# EasyEDA Pro project 单轴带屏幕.eprj, board PCB
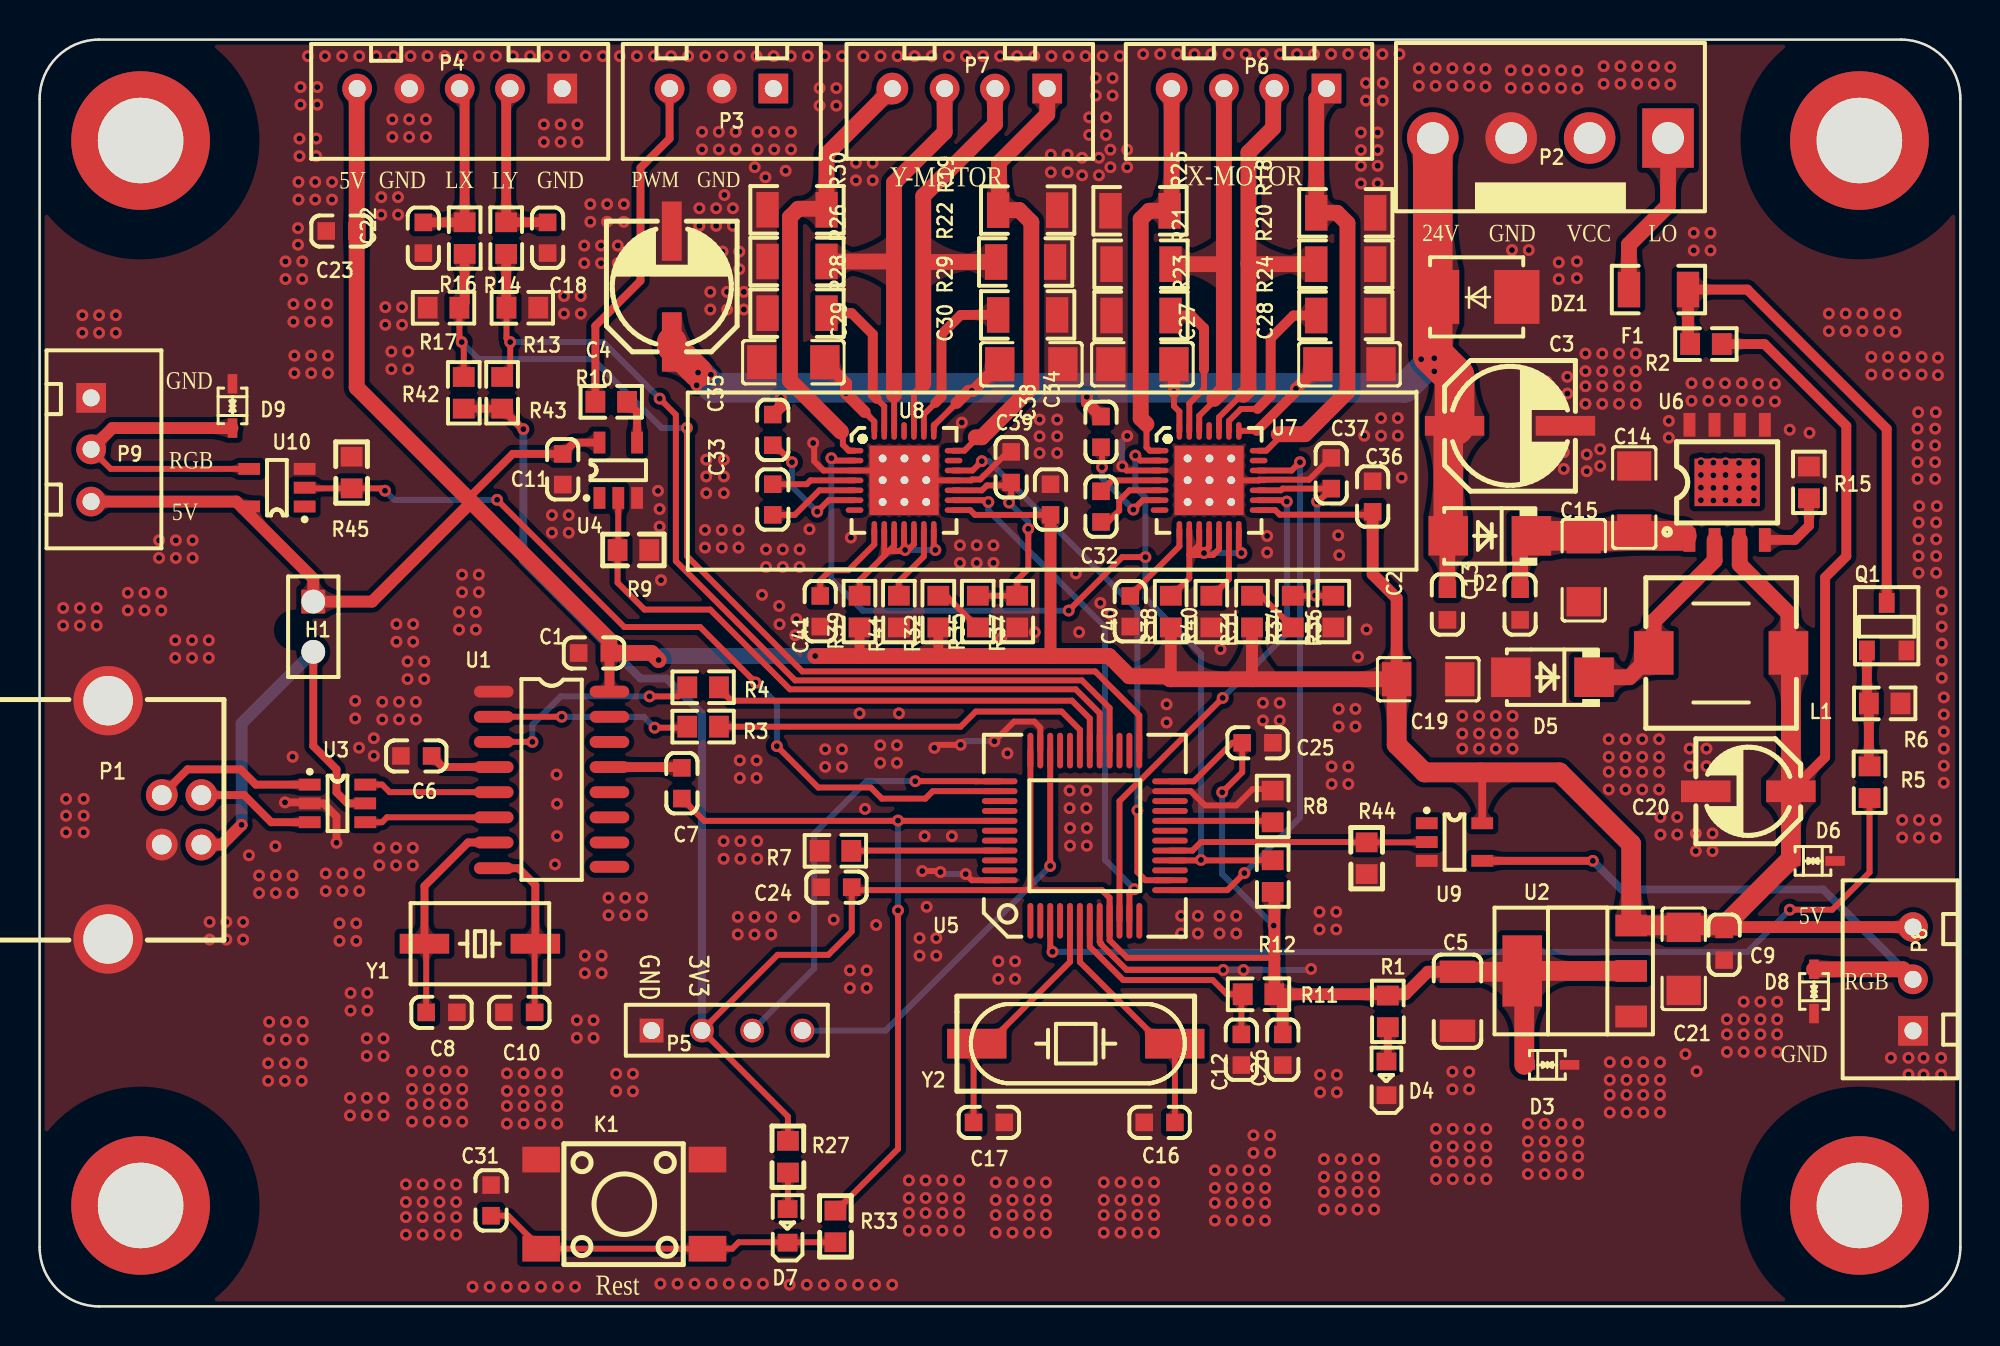
[diagram p1: board, top side]
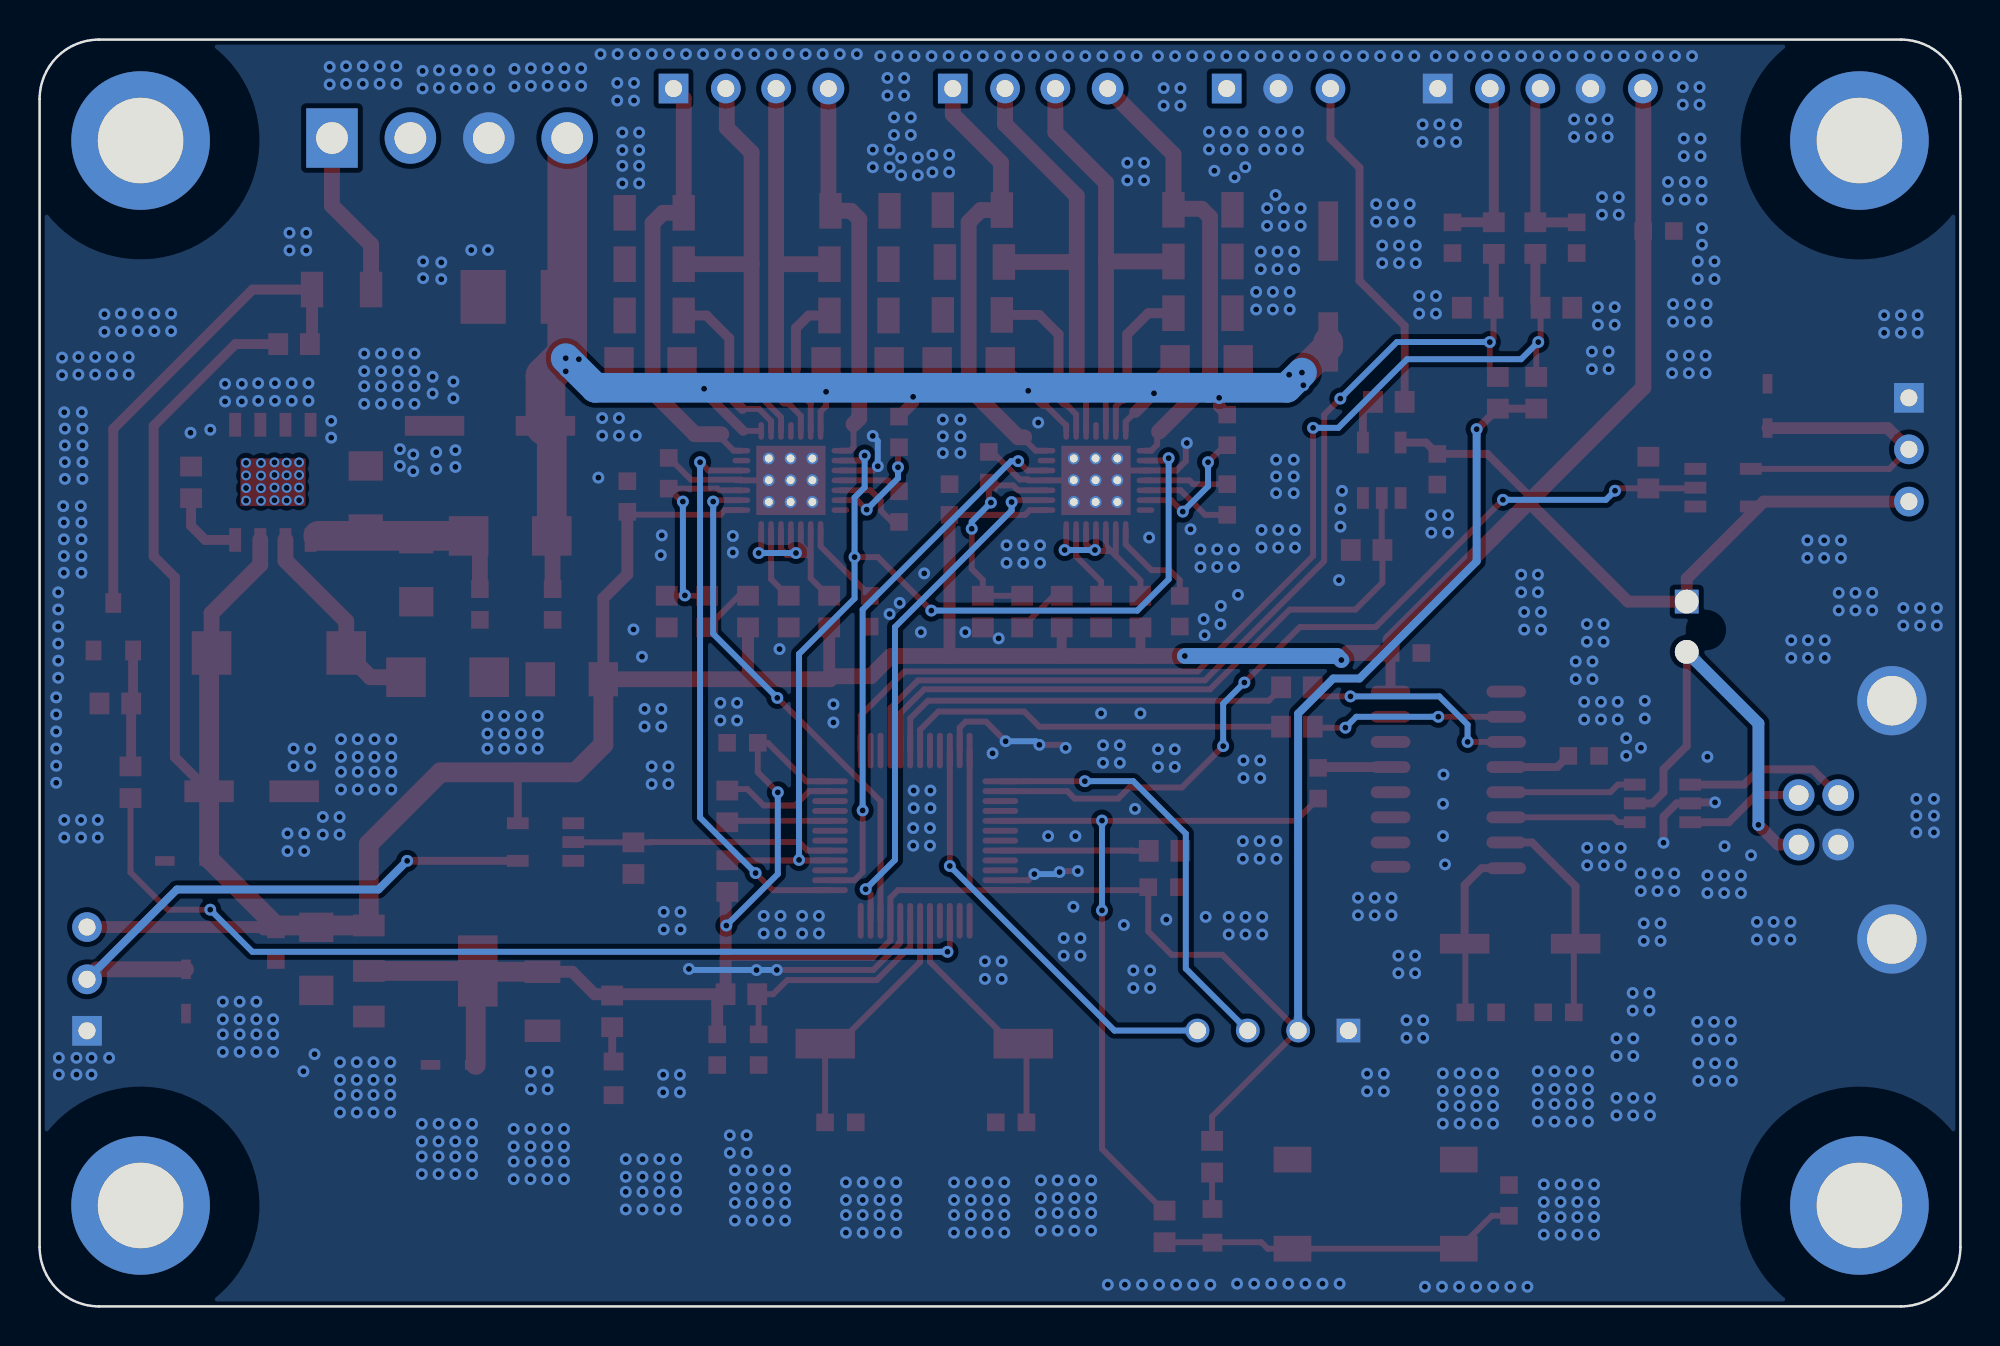
[diagram p2: board, bottom side, seen from below]

Outline 97 x 64 mm; copper layers: Top Layer, Bottom Layer. Coordinates in mm from the lower left corner of the outline.
Outline path: 0,61 0,3 arc(0.88,0.88) 3,0 94,0 arc(96.12,0.88) 97,3 97,61 arc(96.12,63.12) 94,64 3,64 arc(0.88,63.12) 0,61
Stack: Top Layer 0.035mm / Dielectric1 1.51mm FR4 er 4.5 / Bottom Layer 0.035mm

## Design rules (mm)
template: 用户自定义配置
spacing Default (default): track to track 0.152, other pairs 0 to 0.152
track width Default (default): min 0.254, default 0.254, max 25.4
differential pair differentialPair (default): width min 0.127, default 0.254, max 2.54; gap min 0.152, default 0.152
via Default (default): diameter min 0.25, default 0.61, max 100.025; hole min 0.2, default 0.305, max 59.995

## Placement (name value [footprint] x y rotation side)
C1  104  [0603C]  28 33.01 180 top
C2  104  [0603C]  71.09 35.46 270 top
C3  100uF/35V  [电解电容贴片6X6]  74.26 44.49 0 top
C4  100uF/35V  [电解电容贴片6X6]  31.93 51.52 90 top
C5  106/50V  [1206C]  71.6 15.42 270 top
C6  104  [0603C]  19.02 27.81 180 top
C7  104  [0603C]  32.44 26.43 270 top
C8  18pF  [0603C]  20.3 14.86 0 top
C9  104  [0603C]  85.07 18.27 90 top
C10  18pF  [0603C]  24.22 14.86 180 top
C11  104  [0603C]  26.42 42.29 90 top
C12  104  [0603C]  60.69 12.97 90 top
C13  104  [0603C]  74.77 35.46 90 top
C14  10uF  [C1206]  80.53 40.87 90 top
C15  10uF  [C1206]  77.98 37.19 90 top
C16  100pF  [0603C]  56.56 9.3 180 top
C17  100pF  [0603C]  47.94 9.3 0 top
C18  104  [0603C]  25.65 53.99 270 top
C19  10uF  [C1206]  70.12 31.69 0 top
C20  100uF/10V  [CAP-SMD_BD5.0-L5.3-W5.3-RD]  86.29 26.02 0 top
C21  10uF  [C1206]  83.03 17.56 270 top
C22  104  [0603C]  19.38 53.99 90 top
C23  104  [0603C]  15.25 54.33 0 top
C24  104  [0603C]  40.24 21.18 0 top
C25  104  [0603C]  61.51 28.47 180 top
C26  104  [0603C]  62.78 12.97 90 top
C27  10uF  [C1206]  55.69 47.6 180 top
C28  10uF  [C1206]  66.15 47.6 0 top
C29  10uF  [C1206]  38.06 47.7 180 top
C30  10uF  [C1206]  50.08 47.6 0 top
C31  103  [0603C]  22.8 5.36 270 top
C32  104  [0603C]  53.6 40.41 270 top
C33  104  [0603C]  37.03 40.76 270 top
C34  104  [0603C]  53.6 44.18 90 top
C35  104  [0603C]  37.03 44.28 90 top
C36  104  [0603C]  67.32 40.92 90 top
C37  104  [0603C]  65.23 42.09 90 top
C38  104  [0603C]  51.05 40.76 90 top
C39  104  [0603C]  49.06 42.4 90 top
C40  224  [0603C]  55.08 35.12 270 top
C41  224  [0603C]  39.42 35.12 270 top
D2  SS56  [SMA]  73.24 38.93 180 top
D3  PESD3V3L1BA-N  [SOD-323_L1.8-W1.3-LS2.5-BI]  76.14 12.2 180 top
D4  绿光  [0603LED]  68.03 11.49 270 top
D5  SS34  [SMA]  76.4 31.79 180 top
D6  PESD5V0L1BA-N  [SOD-323_L1.8-W1.3-LS2.5-BI]  89.56 22.51 180 top
D7  绿光  [0603LED]  37.79 4.04 270 top
D8  绿光  [SOD-323_L1.8-W1.3-LS2.5-BI]  89.61 15.91 90 top
D9  绿光  [SOD-323_L1.8-W1.3-LS2.5-BI]  9.74 45.49 270 top
DZ1  SMBJ28A  [SMB]  72.57 51 0 top
F1  6V/0.75A  [1206R]  81.75 51.37 180 top
H1  PZ254V-11-02P  [HDR-TH_2P-P2.54-V-M]  13.82 34.34 270 top
K1  SW_6X6_H=12.0MM  [KEY-SMD_4P-L6.0-W6.0-P4.50-LS9.0]  29.53 5.17 0 top
L1  68uH  [IND-SMD_L7.0-W7.0_SMDRI74-330MT]  84.92 33.01 180 top
NOREF  -  [Pad_ie3625]  42.57 40.64 180 top
NOREF#2  -  [Pad_ie3626]  60.18 42.84 0 top
NOREF#3  -  [Pad_ie3620]  42.57 41.74 180 top
NOREF#4  -  [Pad_ie3627]  59.08 42.84 0 top
NOREF#5  -  [Pad_ie3619]  42.57 42.84 180 top
NOREF#6  -  [Pad_ie3]  91.9 5.1 180 top
NOREF#7  -  [Pad_ie3628]  57.98 42.84 180 top
NOREF#8  -  [Pad_ie1]  5.1 58.9 0 top
NOREF#9  -  [Pad_ie3634]  57.98 40.64 180 top
NOREF#10  -  [Pad_ie3617]  44.77 42.84 0 top
NOREF#11  -  [Pad_ie3631]  60.18 41.74 0 top
NOREF#12  -  [Pad_ie0]  5.1 5.1 90 top
NOREF#13  -  [Pad_ie3622]  44.77 41.74 0 top
NOREF#14  -  [Pad_ie2]  91.9 58.9 270 top
NOREF#15  -  [Pad_ie3624]  43.67 40.64 270 top
NOREF#16  -  [Pad_ie3629]  57.98 41.74 180 top
NOREF#17  -  [Pad_ie3633]  59.08 40.64 270 top
NOREF#18  -  [Pad_ie3632]  60.18 40.64 0 top
NOREF#19  -  [Pad_ie3623]  44.77 40.64 0 top
NOREF#20  -  [Pad_ie3630]  59.08 41.74 270 top
NOREF#21  -  [Pad_ie3618]  43.67 42.84 0 top
NOREF#22  -  [Pad_ie3621]  43.67 41.74 270 top
P1  TYPE-C 16PIN  [USB-B-TH_USB-B10-BRW]  5.81 24.58 270 top
P2  Header 4  [VH3.96-4P直插座]  76.3 59.33 0 top
P3  3P  [HDR1X3_CON]  34.45 61.53 180 top
P4  Header 5  [HDR1X5_CON]  21.21 61.53 180 top
P5  4P  [SIP4]  30.91 13.94 0 top
P6  4P  [HDR1X4_CON]  64.89 61.53 180 top
P7  4P  [HDR1X4_CON]  50.78 61.53 180 top
P8  3P  [HDR1X3_CON]  94.61 16.52 90 top
P9  2P  [HDR1X3_CON]  2.6 43.3 270 top
Q1  S8050  [SOT-23]  93.28 34.34 0 top
R1  10K  [0603R]  68.08 14.91 270 top
R2  5.1K  [0603R]  84.15 48.62 180 top
R3  510Ω  [0603R]  33.51 29.29 0 top
R4  510Ω  [0603R]  33.51 31.28 0 top
R5  2K  [0603R]  92.41 26.48 270 top
R6  10K  [0603R]  93.18 30.46 0 top
R7  10K  [0603R]  40.19 23.02 0 top
R8  10K  [0603R]  62.27 25.26 270 top
R9  10K  [0603R]  29.99 38.21 0 top
R10  100  [0603R]  28.87 45.7 0 top
R11  10K  [0603R]  61.56 15.77 180 top
R12  10K  [0603R]  62.27 21.74 270 top
R13  10K  [0603R]  24.38 50.45 180 top
R14  100Ω  [0603R]  23.56 53.97 270 top
R15  10K  [0603R]  89.35 41.63 90 top
R16  100Ω  [0603R]  21.46 53.97 270 top
R17  10K  [0603R]  20.4 50.45 180 top
R18  1.91K  [1206R]  65.96 55.25 0 top
R19  1.91K  [1206R]  49.9 55.39 0 top
R20  1.91K  [1206R]  65.96 52.65 0 top
R21  1.91K  [1206R]  55.62 52.65 180 top
R22  1.91K  [1206R]  49.79 52.76 0 top
R23  0.1  [1206R]  55.62 50.06 180 top
R24  0.1  [1206R]  65.96 50.06 180 top
R25  1.91K  [1206R]  55.57 55.35 180 top
R26  1.91K  [1206R]  38.25 52.79 180 top
R27  10K  [0603R]  37.79 7.56 90 top
R28  0.1  [1206R]  38.25 50.18 180 top
R29  0.1  [1206R]  49.9 50.09 180 top
R30  1.91K  [1206R]  38.25 55.4 180 top
R31  10K  [0603R]  61.23 35.1 270 top
R32  10K  [0603R]  45.39 35.1 270 top
R33  100  [0603R]  40.19 4.04 270 top
R34  10K  [0603R]  63.28 35.1 90 top
R35  10K  [0603R]  47.38 35.1 90 top
R36  10K  [0603R]  65.33 35.1 270 top
R37  10K  [0603R]  49.37 35.1 270 top
R38  10K  [0603R]  57.13 35.1 90 top
R39  10K  [0603R]  41.41 35.1 90 top
R40  10K  [0603R]  59.17 35.1 270 top
R41  10K  [0603R]  43.39 35.1 270 top
R42  10K  [0603R]  21.42 46.16 270 top
R43  10K  [0603R]  23.36 46.16 90 top
R44  10K  [0603R]  67.01 22.64 270 top
R45  100  [0603R]  15.76 42.13 90 top
U1  CH340G  [SOP16]  25.86 27.25 0 top
U2  1117-3.3  [SOT-223]  77.67 16.95 90 top
U3  USBLC2-2SC6  [SOT-23-6]  15.04 25.41 0 top
U4  74LVC1G17  [SOT-23-5]  29.22 42.24 90 top
U5  GD32F303CCT6  [LQFP48]  52.78 23.78 90 top
U6  XL1509-5.0E1  [ESOP-8_L4.9-W3.9-P1.27-LS6.0-BL-EP]  85.22 41.63 0 top
U7  HR4988SQ  [QFN28]  59.32 41.63 270 top
U8  HR4988SQ  [QFN28]  43.91 41.63 270 top
U9  74LVC1G17  [SOT-23-5]  71.45 23.46 0 top
U10  74LVC1G17  [SOT-23-5]  11.98 41.36 180 top
Y1  12M  [晶振贴片49SSMD]  22.23 18.32 180 top
Y2  8M  [晶振贴片]  52.33 13.27 0 top

## Footprints (pads in the part's own frame, mm; a bottom-side part is the same pattern mirrored in y, then rotated)
0603C
  rect 0.889x0.889 smd: 1(-0.774,0) 2(0.774,0)
0603LED
  rect 0.9x1 smd: 1(-0.884,-0.017) 2(0.816,-0.017)
0603R
  rect 1x1.1 smd: 1(-0.8,0) 2(0.8,0)
1206C
  rect 1.13x1.8 smd: 1(-1.49,0) 2(1.49,0)
1206R
  rect 1.13x1.8 smd: 1(-1.49,0) 2(1.49,0)
C1206
  rect 1.485x1.728 smd: 1(-1.593,0) 2(1.593,0)
CAP-SMD_BD5.0-L5.3-W5.3-RD
  rect 2.5x1.1 smd: 1(2.15,0) 2(-2.15,0)
ESOP-8_L4.9-W3.9-P1.27-LS6.0-BL-EP
  rect 0.6x1.2 smd: 1(-1.905,-2.909) 2(-0.635,-2.909) 3(0.635,-2.909) 4(1.905,-2.909) 5(1.905,2.909) 6(0.635,2.909) 7(-0.635,2.909) 8(-1.905,2.909)
  rect 3.3x2.4 smd: 9(0,0)
HDR1X3_CON
  rect 1.5x1.5 hole 0.86: 1(-2.6,0)
  round 1.5 hole 0.86: 2(0,0) 3(2.64,0)
HDR1X4_CON
  rect 1.5x1.5 hole 0.86: 1(-0.1,0)
  round 1.5 hole 0.86: 2(2.54,0) 3(5.08,0)
  round 1.6 hole 0.85: 4(7.72,0)
HDR1X5_CON
  rect 1.5x1.5 hole 0.86: 1(-5.18,0)
  round 1.5 hole 0.86: 2(-2.54,0) 3(0,0) 4(2.54,0) 5(5.18,0)
HDR-TH_2P-P2.54-V-M
  rect 1.2x1.2 hole 1.2x0.8: 1(-1.27,0)
  round 1.2 hole 1.2x0.8: 2(1.27,0)
IND-SMD_L7.0-W7.0_SMDRI74-330MT
  rect 2x2.2 smd: 1(-3.4,0) 2(3.4,0)
KEY-SMD_4P-L6.0-W6.0-P4.50-LS9.0
  rect 1.9x1.3 smd: 1(-4.2,2.25) 2(4.2,2.25) 3(-4.2,-2.25) 4(4.2,-2.25)
LQFP48
  oval 1.8x0.3 smd: 1(-4.3,2.75) 2(-4.3,2.25) 3(-4.3,1.75) 4(-4.3,1.25) 5(-4.3,0.75) 6(-4.3,0.25) 7(-4.3,-0.25) 8(-4.3,-0.75) 9(-4.3,-1.25) 10(-4.3,-1.75) 11(-4.3,-2.25) 12(-4.3,-2.75) 25(4.3,-2.75) 26(4.3,-2.25) 27(4.3,-1.75) 28(4.3,-1.25) 29(4.3,-0.75) 30(4.3,-0.25) 31(4.3,0.25) 32(4.3,0.75) 33(4.3,1.25) 34(4.3,1.75) 35(4.3,2.25) 36(4.3,2.75)
  oval 0.3x1.8 smd: 13(-2.75,-4.3) 14(-2.25,-4.3) 15(-1.75,-4.3) 16(-1.25,-4.3) 17(-0.75,-4.3) 18(-0.25,-4.3) 19(0.25,-4.3) 20(0.75,-4.3) 21(1.25,-4.3) 22(1.75,-4.3) 23(2.25,-4.3) 24(2.75,-4.3) 37(2.75,4.3) 38(2.25,4.3) 39(1.75,4.3) 40(1.25,4.3) 41(0.75,4.3) 42(0.25,4.3) 43(-0.25,4.3) 44(-0.75,4.3) 45(-1.25,4.3) 46(-1.75,4.3) 47(-2.25,4.3) 48(-2.75,4.3)
Pad_ie0
  round 7 hole 4.32: 0(0,0)
Pad_ie1
  round 7 hole 4.32: 0(0,0)
Pad_ie2
  round 7 hole 4.32: 0(0,0)
Pad_ie3
  round 7 hole 4.32: 0(0,0)
Pad_ie3617
  round 0.6 hole 0.4: 5(0,0)
Pad_ie3618
  round 0.6 hole 0.4: 4(0,0)
Pad_ie3619
  round 0.6 hole 0.4: 5(0,0)
Pad_ie3620
  round 0.6 hole 0.4: 5(0,0)
Pad_ie3621
  round 0.6 hole 0.4: 5(0,0)
Pad_ie3622
  round 0.6 hole 0.4: 5(0,0)
Pad_ie3623
  round 0.6 hole 0.4: 5(0,0)
Pad_ie3624
  round 0.6 hole 0.4: 5(0,0)
Pad_ie3625
  round 0.6 hole 0.4: 5(0,0)
Pad_ie3626
  round 0.6 hole 0.4: 5(0,0)
Pad_ie3627
  round 0.6 hole 0.4: 4(0,0)
Pad_ie3628
  round 0.6 hole 0.4: 5(0,0)
Pad_ie3629
  round 0.6 hole 0.4: 5(0,0)
Pad_ie3630
  round 0.6 hole 0.4: 5(0,0)
Pad_ie3631
  round 0.6 hole 0.4: 5(0,0)
Pad_ie3632
  round 0.6 hole 0.4: 5(0,0)
Pad_ie3633
  round 0.6 hole 0.4: 5(0,0)
Pad_ie3634
  round 0.6 hole 0.4: 5(0,0)
QFN28
  oval 0.28x0.895 smd: 1(-1.601,-2.756) 2(-1.101,-2.756) 3(-0.601,-2.756) 4(-0.1,-2.756) 5(0.401,-2.756) 6(0.9,-2.756) 7(1.401,-2.756) 15(1.401,2.244) 16(0.9,2.244) 17(0.401,2.244) 18(-0.1,2.244) 19(-0.601,2.244) 20(-1.101,2.244) 21(-1.601,2.244)
  oval 0.895x0.28 smd: 8(2.4,-1.758) 9(2.4,-1.257) 10(2.4,-0.756) 11(2.4,-0.256) 12(2.4,0.244) 13(2.4,0.745) 14(2.4,1.245) 22(-2.6,1.245) 23(-2.6,0.745) 24(-2.6,0.244) 25(-2.6,-0.256) 26(-2.6,-0.756) 27(-2.6,-1.257) 28(-2.6,-1.758)
  rect 3.5x3.5 smd: 29(-0.1,-0.256)
SIP4
  rect 1.2x1.2 hole 0.86: 1(0,0)
  round 1.2 hole 0.86: 2(2.54,0) 3(5.08,0) 4(7.62,0)
SMA
  rect 2x2 smd: 1(2.1,0) 2(-2.1,0)
SMB
  rect 2.29x2.72 smd: 1(2.025,0) 2(-2.025,0)
SOD-323_L1.8-W1.3-LS2.5-BI
  rect 0.986x0.49 smd: 1(-1.117,0) 2(1.117,0)
SOP16
  oval 2x0.6 smd: 1(-2.921,3.81) 2(-2.921,2.54) 3(-2.921,1.27) 4(-2.921,0) 5(-2.921,-1.27) 6(-2.921,-2.54) 7(-2.921,-3.81) 8(-2.921,-5.11) 9(2.921,-5.04) 10(2.921,-3.81) 11(2.921,-2.54) 12(2.921,-1.27) 13(2.921,0) 14(2.921,1.27) 15(2.921,2.54) 16(2.921,3.81)
SOT-23
  rect 0.8x1 smd: 1(-1,-1.2) 2(0,1.2) 3(1,-1.2)
SOT-23-5
  rect 1.1x0.6 smd: 1(-1.4,0.95) 2(-1.4,0) 3(-1.4,-0.95) 4(1.4,-0.95) 5(1.4,0.95)
SOT-23-6
  rect 1.1x0.6 smd: 1(-1.4,0.95) 2(-1.4,0) 3(-1.4,-0.95) 4(1.4,-0.95) 5(1.4,0) 6(1.4,0.95)
SOT-223
  rect 1.1x1.6 smd: 1(-2.3,-2.7) 2(0,-2.7) 3(2.3,-2.7)
  rect 3.6x2 smd: 4(0,2.8)
USB-B-TH_USB-B10-BRW
  round 1.6 hole 1: 1(1.25,2.355) 2(-1.25,2.355) 3(-1.25,0.355) 4(1.25,0.355)
  round 3.5 hole 2.5: 5(-6.02,-2.355) 6(6.02,-2.355)
VH3.96-4P直插座
  rect 2.6x3 hole 1.6: 1(5.94,-0.3)
  round 2.6 hole 1.6: 2(1.98,-0.3) 3(-1.98,-0.3) 4(-5.94,-0.3)
晶振贴片
  rect 3x1.5 smd: 1(-5,0) 2(5,0)
晶振贴片49SSMD
  rect 2.5x1 smd: 1(-2.8,0) 2(2.8,0)
电解电容贴片6X6
  rect 3x1 smd: 1(-2.8,0) 2(2.8,0)

## Nets
3V3: C5.1 C24.2 C25.2 C26.2 D3.2 P5.2 R1.1 R11.1 R12.2 R27.2 R42.2 R43.1 U2.2 U2.4 U5.9 U5.24 U5.36 U5.48
5VV: P2.2
24V: C13.2 C14.1 C15.2 D2.2 U6.1
GND: C1.2 C2.2 C3.2 C4.2 C5.2 C6.2 C8.2 C9.1 C10.2 C11.1 C12.1 C13.1 C14.2 C15.1 C16.2 C17.2 C18.2 C19.2 C20.2 C21.2 C22.1 C23.1 C24.1 C25.1 C26.1 C27.2 C28.2 C29.2 C30.2 C31.1 C36.2 C37.2 C38.2 C39.2 C40.2 C41.2 D3.1 D4.2 D5.1 D6.1 D8.1 D9.1 DZ1.1 K1.1 K1.2 NOREF.5 NOREF#2.5 NOREF#3.5 NOREF#4.4 NOREF#5.5 NOREF#7.5 NOREF#9.5 NOREF#10.5 NOREF#11.5 NOREF#13.5 NOREF#15.5 NOREF#16.5 NOREF#17.5 NOREF#18.5 NOREF#19.5 NOREF#20.5 NOREF#21.4 NOREF#22.5 P1.4 P1.5 P1.6 P2.3 P3.2 P4.1 P4.4 P5.1 P8.1 P9.1 Q1.3 R6.2 R7.1 R8.1 R9.2 R13.1 R15.2 R17.2 R18.2 R19.2 R20.2 R21.2 R22.2 R23.2 R24.1 R25.2 R26.2 R28.2 R29.1 R30.2 R36.2 R37.2 R40.2 R41.2 R44.2 R45.2 U1.1 U2.1 U3.2 U4.3 U5.8 U5.23 U5.35 U5.47 U6.5 U6.6 U6.7 U6.8 U7.3 U7.18 U7.29 U8.3 U8.18 U8.29 U9.3 U10.3
VCC: C1.1 C9.2 C11.2 C19.1 C20.1 C21.1 C23.2 C36.1 C38.1 D6.2 H1.1 L1.1 P4.5 P8.3 P9.3 R2.1 R31.2 R32.2 R38.1 R39.1 U1.16 U2.3 U4.5 U6.3 U7.15 U8.15 U9.5 U10.5
BOOT0: R7.2 U5.44
BOOT1: R8.2 U5.20
COOLANT_FLOOD: U5.39
COOLANT_MIST: U5.40
EX1: U5.42
EX2: U5.43
EX3: U5.4
GYRO_RX: U5.22
GYRO_TX: U5.21
LASER_LOCATION: U5.19
LO: R5.2 U5.3
LO_OUT: F1.2 P2.1
LX_O: C22.2 P4.3 R16.1
LY_O: C18.1 P4.2 R14.1
MOTOR_EN: R12.1 U5.16 U7.2 U8.2
MX_1A: P6.2 R20.1 U7.24
MX_1B: P6.1 R18.1 U7.21
MX_2A: P6.3 R21.1 U7.26
MX_2B: P6.4 R25.1 U7.1
MX_DIR: U5.13 U7.19
MX_STEP: U5.10 U7.16
MY1_1A: P7.2 R22.1 U8.24
MY1_1B: P7.1 R19.1 U8.21
MY1_2A: P7.3 R26.1 U8.26
MY1_2B: P7.4 R30.1 U8.1
MY_DIR: U5.14 U8.19
MY_STEP: U5.11 U8.16
MZ_DIR: U5.15
MZ_STEP: U5.12
NRST: C12.2 R11.2 U5.7
PA7_SPI: R44.1 U5.17 U9.2
PA15: R45.1 U5.38 U10.2
PA15_TIM2: D9.2 P9.2 U10.4
PWM_5V: P3.3 R10.1
RGB_SPI: D8.2 P8.2 U9.4
RST: C7.2 R33.1 U5.41
RXD: R3.2 U5.31
SAFETY_DOOR: U5.45
SPINDLE_DIR: U5.27
SPINDLE_EN: U5.26
SPINDLE_PWM: R9.1 U4.2 U5.29
SWCLK: P5.3 U5.37
SWDIO: P5.4 U5.34
TXD: R4.2 U5.30
USB_DM: P1.2 U3.3
USB_DP: P1.3 U3.1
USBV_CK: U5.18
VM: C2.1 C3.1 C4.1 C27.1 C28.1 C29.1 C30.1 C34.2 C35.2 D2.1 DZ1.2 P2.4 U7.22 U7.28 U8.22 U8.28
VUSB: H1.2 P1.1 U3.5
X_LIMT: R16.2 R17.1 R42.1 U5.25
XTAL1: C17.1 U5.5 Y2.1
XTAL2: C16.1 U5.6 Y2.2
Y_LIMT: R13.2 R14.2 R43.2 U5.28
$1N85772: U5.32
$1N85774: U5.33
$1N85780: U5.46
$1N85854: U5.2
$1N85912: C32.2 U7.5
$1N85916: C32.1 U7.4
$1N85918: C34.1 U7.6
$1N85922: C40.1 U7.8
$1N85924: R40.1 U7.13
$1N85949: R24.2 U7.23
$1N85962: R23.1 U7.27
$1N85980: C33.2 U8.5
$1N85984: C33.1 U8.4
$1N85986: C35.1 U8.6
$1N85990: C41.1 U8.8
$1N85992: R41.1 U8.13
$1N86002: C39.1 R35.2 R37.1 U8.17
$1N86020: R29.2 U8.23
$1N86033: R28.1 U8.27
$1N86106: R38.2 U7.9 U7.10 U7.11 U7.12 U7.14
$1N86116: R39.2 U8.9 U8.10 U8.11 U8.12 U8.14
$1N86149: C6.1 U1.4
$1N86156: C7.1 U1.13
$1N86170: U1.5 U3.6
$1N86179: U1.6 U3.4
$1N86183: C8.1 U1.7 Y1.2
$1N86186: C10.1 U1.8 Y1.1
$1N86190: R10.2 U4.4
$1N86205: F1.1 Q1.2 R2.2
$1N86244: Q1.1 R5.1 R6.1
$1N86264: D4.1 R1.2
$1N86304: R3.1 U1.2
$1N86306: R4.1 U1.3
$1N86352: C31.2 D7.2 K1.3 K1.4 R33.2
$1N86386: D7.1 R27.1
$1N86869: D5.2 L1.2 U6.2
$1N86871: R15.1 U6.4
$1N92113: R31.1 R34.1
$1N92147: C37.1 R34.2 R36.1 U7.17
$1N92216: R32.1 R35.1

Pads without a net: NOREF#6 0; NOREF#8 0; NOREF#12 0; NOREF#14 0; P3 1; U1 9 10 11 12 14 15; U4 1; U5 1; U6 9; U7 7 20 25; U8 7 20 25; U9 1; U10 1

## Via types
v1: diameter 0.5, hole 0.3, Top Layer to Bottom Layer, 20 vias
v2: diameter 0.6, hole 0.3, Top Layer to Bottom Layer, 988 vias

## Routing (per net, layer and track width the routed paths; a pad name or vN(x,y) marks a point on that pad's centre or on a via; arc(x,y) is an arc through that point)
3V3: length 134.6
  Top Layer w0.3: 50.07,21.03 53.65,21.03 54.03,20.64 U5.9 54.03,18.5 54.93,17.61 62.3,17.61 62.36,17.55 ; 50.07,21.03 U5.48 41.16,21.03 C24.2 41.01,18.95 39.83,17.76 37.27,17.76 P5.2 37.79,9.59 37.79,8.36 ; 50.07,21.03 50.03,21.06 U5.36 ; U5.24 58.29,26.53 60.23,28.47 C25.2 60.73,26.98 v2(59.72,25.97)
  Top Layer w0.4: v2(24.43,44.32) 24.39,44.32 R43.1 ; 21.42,45.36 23.36,45.36
  Top Layer w0.6: R11.1 62.36,20.85 62.27,20.94 ; R11.1 62.78,15.35 C26.2 ; R11.1 68.97,15.77 70.1,16.91 C5.1
  Top Layer w1: 74.91,16.91 U2.4 ; 74.91,16.91 75.06,16.91 75.1,16.95 U2.2 ; 74.91,16.91 C5.1 ; 74.91,16.91 74.97,16.84 74.97,12.2
  Bottom Layer w0.3: v2(59.72,25.97) 59.72,21.84 v2(62.32,19.24)
  Bottom Layer w0.4: v2(24.43,44.32) 24.43,37.64 30.34,31.72 31.67,31.72 33.45,29.95 P5.2
24V: length 10.5
  Top Layer w0.8: C13.2 74.77,38.36 D2.2
  Top Layer w1.5: 82.93,38.93 D2.2
GND: length 55.9
  Top Layer w0.3: C39.2 48.89,43.17 47.5,41.78 47.09,41.78 47.04,41.73 U8.29 ; v2(45.19,28.22) 45.34,28.37 v2(46.51,28.37) ; 43.65,41.73 43.15,42.23 39.59,42.23 39.12,42.7 39.12,43.57 v2(39.07,43.62) ; C37.2 65.2,42.86 64.11,41.77 61.6,41.77 U7.18 U7.29 ; U5.35 50.53,29.24 50.23,29.54 49.21,29.54 v2(48.22,28.55) ; v2(59.77,17) 54.9,17 53.58,18.31 53.61,18.34 53.53,18.42 U5.8 ; v2(44.57,22) 45.44,22 v2(45.49,21.94) ; v2(46.77,21.84) 47.08,21.53 U5.47 ; v2(54.67,42.45) 54.89,42.23 U7.3 ; R8.1 62.2,26.13 61.26,26.13 60.43,25.31 58.85,25.31 58.13,26.03 U5.23
  Top Layer w0.4: v2(14.99,23.42) 14.99,24.75 14.33,25.41 U3.2 13.59,25.46 v2(12.39,25.46)
  Bottom Layer w0.3: v2(46.51,28.37) 46.69,28.55 v2(48.22,28.55) ; v2(54.93,43.98) 54.67,43.72 v2(54.67,42.45) ; v2(59.77,17) 64.16,17 v2(64.21,17.05) ; v2(45.49,21.94) 45.59,21.84 v2(46.77,21.84)
  vias: v2(1.19,35.29) v2(1.19,34.4) v2(1.34,25.64) v2(1.34,24.79) v2(1.34,23.95) v2(2.04,35.29) v2(2.04,34.4) v2(2.16,50.08) v2(2.16,49.19) v2(2.22,25.64) v2(2.22,24.79) v2(2.22,23.95) v2(2.88,35.29) v2(2.88,34.4) v2(3,50.08) v2(3,49.19) v2(3.85,50.08) v2(3.85,49.19) v2(4.45,36.05) v2(4.45,35.16) v2(5.3,36.05) v2(5.3,35.16) v2(6.03,38.7) v2(6.03,37.81) v2(6.15,36.05) v2(6.15,35.16) v2(6.88,38.7) v2(6.88,37.81) v2(6.85,33.65) v2(6.85,32.76) v2(7.73,38.7) v2(7.73,37.81) v2(7.7,33.65) v2(7.7,32.76) v2(8.54,33.65) v2(8.54,32.76) v2(8.58,19.42) v2(8.58,18.54) v2(9.43,19.42) v2(9.43,18.54) v2(10.28,19.42) v2(10.28,18.54) v2(10.57,22.79) v2(11.08,21.77) v2(11.08,20.88) v2(11.54,12.28) v2(11.54,11.4) v2(11.59,14.38) v2(11.59,13.49) v2(11.91,23.25) v2(11.93,21.77) v2(11.93,20.88) v2(12.42,52.79) v2(12.42,51.9) v2(12.44,14.38) v2(12.44,13.49) v2(12.39,12.28) v2(12.39,11.4) v2(12.82,50.64) v2(12.82,49.75) v2(12.78,27.77) v2(12.78,21.77) v2(12.78,20.88) v2(12.87,48.04) v2(12.87,47.15) v2(13.12,59) v2(13.12,58.11) v2(13.07,56.81) v2(13.07,55.92) v2(13.05,54.48) v2(13.05,53.64) v2(13.17,61.6) v2(13.17,60.71) v2(13.23,12.28) v2(13.23,11.4) v2(13.26,52.79) v2(13.26,51.9) v2(13.29,14.38) v2(13.29,13.49) v2(13.55,63.16) v2(13.66,50.64) v2(13.66,49.75) v2(13.71,48.04) v2(13.71,47.15) v2(13.92,56.81) v2(13.92,55.92) v2(14.02,61.6) v2(14.02,60.71) v2(13.97,59) v2(13.97,58.11) v2(14.41,63.16) v2(14.51,50.64) v2(14.51,49.75) v2(14.45,21.87) v2(14.45,20.98) v2(14.56,48.04) v2(14.56,47.15) v2(14.77,56.81) v2(14.77,55.92) v2(15.14,19.35) v2(15.14,18.47) v2(15.28,63.16) v2(15.3,21.87) v2(15.3,20.98) v2(15.7,15.84) v2(15.7,14.95) v2(15.68,10.54) v2(15.68,9.65) v2(15.94,30.59) v2(15.94,29.7) v2(15.99,19.35) v2(15.99,18.47) v2(16.14,63.16) v2(16.13,28.23) v2(16.14,21.87) v2(16.14,20.98) v2(16.52,13.54) v2(16.52,12.65) v2(16.52,10.54) v2(16.52,9.65) v2(16.55,15.84) v2(16.55,14.95) v2(16.88,28.71) v2(16.88,27.82) v2(17,63.16) v2(17.15,23.17) v2(17.15,22.28) v2(17.25,56.04) v2(17.25,55.15) v2(17.3,30.54) v2(17.3,29.65) v2(17.37,13.54) v2(17.37,12.65) v2(17.37,10.54) v2(17.37,9.65) v2(17.46,50.48) v2(17.46,49.59) v2(17.81,59.97) v2(17.81,59.08) v2(17.76,48.24) v2(17.76,47.35) v2(17.87,63.16) v2(18.02,34.47) v2(18.02,33.58) v2(18,23.17) v2(18,22.28) v2(18.1,56.04) v2(18.1,55.15) v2(18.15,30.54) v2(18.15,29.65) v2(18.3,50.48) v2(18.3,49.59) v2(18.5,6.16) v2(18.5,5.28) v2(18.5,4.51) v2(18.5,3.62) v2(18.61,48.24) v2(18.61,47.35) v2(18.58,32.58) v2(18.58,31.69) v2(18.73,63.16) v2(18.66,59.97) v2(18.66,59.08) v2(18.8,11.88) v2(18.8,10.99) v2(18.8,10.23) v2(18.8,9.34) v2(18.87,34.47) v2(18.87,33.58) v2(18.85,23.17) v2(18.85,22.28) v2(19,30.54) v2(19,29.65) v2(19.34,6.16) v2(19.34,5.28) v2(19.34,4.51) v2(19.34,3.62) v2(19.43,32.58) v2(19.43,31.69) v2(19.51,59.97) v2(19.51,59.08) v2(19.59,63.16) v2(19.65,11.88) v2(19.65,10.99) v2(19.65,10.23) v2(19.65,9.34) v2(20.19,6.16) v2(20.19,5.28) v2(20.19,4.51) v2(20.19,3.62) v2(20.45,63.16) v2(20.5,11.88) v2(20.5,10.99) v2(20.5,10.23) v2(20.5,9.34) v2(21.04,6.16) v2(21.04,5.28) v2(21.04,4.51) v2(21.04,3.62) v2(21.18,35.08) v2(21.18,34.19) v2(21.32,63.16) v2(21.33,36.97) v2(21.33,36.08) v2(21.34,11.88) v2(21.34,10.99) v2(21.34,10.23) v2(21.34,9.34) v2(21.86,0.99) v2(22.03,35.08) v2(22.03,34.19) v2(22.18,63.16) v2(22.18,36.97) v2(22.18,36.08) v2(22.73,0.99) v2(23.04,63.16) v2(23.6,11.77) v2(23.6,10.89) v2(23.6,10.12) v2(23.6,9.23) v2(23.59,0.99) v2(23.91,63.16) v2(24.44,11.77) v2(24.44,10.89) v2(24.44,10.12) v2(24.44,9.23) v2(24.45,0.99) v2(24.77,63.16) v2(25.29,11.77) v2(25.29,10.89) v2(25.29,10.12) v2(25.29,9.23) v2(25.32,0.99) v2(25.46,59.71) v2(25.46,58.83) v2(25.63,63.16) v2(25.87,39.98) v2(25.87,39.09) v2(26.03,22.33) v2(26.1,26.87) v2(26.13,25.39) v2(26.13,23.76) v2(26.14,11.77) v2(26.14,10.89) v2(26.14,10.12) v2(26.14,9.23) v2(26.18,0.99) v2(26.31,59.71) v2(26.31,58.83) v2(26.5,63.16) v2(26.48,51.04) v2(26.48,50.16) v2(26.72,39.98) v2(26.72,39.09) v2(27.04,0.99) v2(27.13,14.46) v2(27.13,13.57) v2(27.16,59.71) v2(27.16,58.83) v2(27.33,51.04) v2(27.33,50.16) v2(27.5,53.59) v2(27.5,52.71) v2(27.54,17.72) v2(27.54,16.83) v2(27.58,63.16) v2(27.81,55.69) v2(27.81,54.8) v2(27.97,14.46) v2(27.97,13.57) v2(28.44,63.16) v2(28.35,53.59) v2(28.35,52.71) v2(28.38,17.72) v2(28.38,16.83) v2(28.66,55.69) v2(28.66,54.8) v2(28.73,20.65) v2(28.73,19.76) v2(29.12,11.76) v2(29.12,10.87) v2(29.2,53.59) v2(29.2,52.71) v2(29.3,63.16) v2(29.5,55.69) v2(29.5,54.8) v2(29.58,20.65) v2(29.58,19.76) v2(29.96,11.76) v2(29.96,10.87) v2(30.17,63.16) v2(30.42,20.65) v2(30.42,19.76) v2(31.03,63.16) v2(31.23,41.2) v2(31.31,40.28) v2(31.31,39.39) v2(31.38,36.69) v2(31.35,1.15) v2(31.89,63.16) v2(32.21,1.15) v2(32.75,63.16) v2(33.08,1.15) v2(33.32,55.48) v2(33.32,54.59) v2(33.45,59.34) v2(33.45,58.45) v2(33.62,63.16) v2(33.64,53.29) v2(33.64,52.4) v2(33.6,39.23) v2(33.6,38.34) v2(33.67,42.78) v2(33.67,41.93) v2(33.67,41.08) v2(33.87,51.25) v2(33.87,50.36) v2(33.94,1.15) v2(34.17,55.48) v2(34.17,54.59) v2(34.3,59.34) v2(34.3,58.45) v2(34.48,63.16) v2(34.49,53.29) v2(34.49,52.4) v2(34.45,39.23) v2(34.45,38.34) v2(34.54,23.5) v2(34.54,22.62) v2(34.58,56.15) v2(34.56,42.78) v2(34.56,41.93) v2(34.56,41.08) v2(34.72,51.25) v2(34.72,50.36) v2(34.8,1.15) v2(35.01,55.48) v2(35.01,54.59) v2(35.15,59.34) v2(35.15,58.45) v2(35.34,63.16) v2(35.33,53.29) v2(35.33,52.4) v2(35.3,39.23) v2(35.3,38.34) v2(35.26,19.68) v2(35.26,18.79) v2(35.36,27.58) v2(35.36,26.7) v2(35.39,23.5) v2(35.39,22.62) v2(35.56,51.25) v2(35.56,50.36) v2(35.67,1.15) v2(36.11,57.55) v2(36.1,19.68) v2(36.1,18.79) v2(36.21,63.16) v2(36.21,27.58) v2(36.21,26.7) v2(36.24,23.5) v2(36.24,22.62) v2(36.25,59.34) v2(36.25,58.45) v2(36.48,35.95) v2(36.53,1.15) v2(36.65,57.04) v2(36.68,38.24) v2(36.68,37.35) v2(36.95,19.68) v2(36.95,18.79) v2(37.07,63.16) v2(37.1,59.34) v2(37.1,58.45) v2(37.35,35.39) v2(37.37,34.46) v2(37.53,38.24) v2(37.53,37.35) v2(37.67,57.37) v2(37.93,63.16) v2(37.88,1.1) v2(37.95,59.34) v2(37.95,58.45) v2(38.11,19.68) v2(38.22,34.72) v2(38.16,33.91) v2(38.38,38.24) v2(38.38,37.35) v2(38.74,1.1) v2(38.79,63.16) v2(38.88,39.26) v2(39.39,61.55) v2(39.39,60.66) v2(39.6,1.1) v2(39.66,63.16) v2(39.67,28.15) v2(39.67,27.26) v2(40.1,19.54) v2(40.23,61.55) v2(40.23,60.66) v2(40.52,63.16) v2(40.52,28.15) v2(40.52,27.26) v2(40.47,1.1) v2(40.92,16.98) v2(40.92,16.09) v2(40.97,38.84) v2(41.22,57.78) v2(41.22,56.89) v2(41.33,1.1) v2(41.41,29.96) v2(41.6,63.16) v2(41.68,25.14) v2(41.77,16.98) v2(41.77,16.09) v2(42.07,57.78) v2(42.07,56.89) v2(42.24,19.27) v2(42.19,1.1) v2(42.46,63.16) v2(42.45,28.35) v2(42.45,27.46) v2(43.06,1.1) v2(43.33,63.16) v2(43.3,28.35) v2(43.3,27.46) v2(43.4,29.96) v2(43.9,6.37) v2(43.9,5.48) v2(43.9,4.72) v2(43.9,3.83) v2(44.19,63.16) v2(44.44,18.61) v2(44.44,17.72) v2(44.69,23.76) v2(44.74,6.37) v2(44.74,5.48) v2(44.74,4.72) v2(44.74,3.83) v2(44.79,20.19) v2(45.05,63.16) v2(45.28,18.61) v2(45.28,17.72) v2(45.59,6.37) v2(45.59,5.48) v2(45.59,4.72) v2(45.59,3.83) v2(45.92,63.16) v2(46.07,23.76) v2(46.44,6.37) v2(46.44,5.48) v2(46.44,4.72) v2(46.44,3.83) v2(46.48,38.45) v2(46.48,37.56) v2(46.57,44.65) v2(46.78,63.16) v2(47.32,38.45) v2(47.32,37.56) v2(47.64,63.16) v2(48.17,38.45) v2(48.17,37.56) v2(48.28,6.27) v2(48.28,5.38) v2(48.28,4.62) v2(48.28,3.73) v2(48.42,17.44) v2(48.42,16.55) v2(48.51,63.16) v2(48.57,33.75) v2(48.87,27.94) v2(49.13,6.27) v2(49.13,5.38) v2(49.13,4.62) v2(49.13,3.73) v2(49.26,17.44) v2(49.26,16.55) v2(49.37,63.16) v2(49.98,6.27) v2(49.98,5.38) v2(49.98,4.62) v2(49.98,3.73) v2(50.23,63.16) v2(50.25,34.06) v2(50.5,44.81) v2(50.5,43.96) v2(50.5,43.11) v2(50.82,6.27) v2(50.82,5.38) v2(50.82,4.62) v2(50.82,3.73) v2(51.09,63.16) v2(51.07,58.18) v2(51.07,57.3) v2(51.39,44.81) v2(51.39,43.96) v2(51.39,43.11) v2(51.91,58.18) v2(51.91,57.3) v2(51.96,63.16) v2(52.01,26.06) v2(52.01,25.17) v2(52.04,24.17) v2(52.04,23.28) v2(52.33,37.03) v2(52.5,34.06) v2(52.65,58.03) v2(52.65,57.14) v2(52.82,63.16) v2(52.86,26.06) v2(52.86,25.17) v2(52.88,24.17) v2(52.88,23.28) v2(53.01,60.07) v2(53.01,59.18) v2(53.34,62.06) v2(53.34,61.17) v2(53.49,58.03) v2(53.49,57.14) v2(53.57,35.54) v2(53.68,63.16) v2(53.74,6.27) v2(53.74,5.38) v2(53.74,4.62) v2(53.74,3.73) v2(53.85,60.07) v2(53.85,59.18) v2(54.08,58.44) v2(54.08,57.55) v2(54.08,34.98) v2(54.19,62.06) v2(54.19,61.17) v2(54.55,63.16) v2(54.59,6.27) v2(54.59,5.38) v2(54.59,4.62) v2(54.59,3.73) v2(54.92,58.44) v2(54.92,57.55) v2(55.43,6.27) v2(55.43,5.38) v2(55.43,4.62) v2(55.43,3.73) v2(55.73,63.27) v2(56.28,6.27) v2(56.28,5.38) v2(56.28,4.62) v2(56.28,3.73) v2(56.59,63.27) v2(56.91,30.42) v2(56.91,29.5) v2(57.45,63.27) v2(57.65,19.73) v2(57.65,18.84) v2(58.32,63.27) v2(58.49,19.73) v2(58.49,18.84) v2(59.18,63.27) v2(59.35,6.88) v2(59.35,5.99) v2(59.35,5.23) v2(59.35,4.34) v2(59.63,33.21) v2(59.58,19.73) v2(59.58,18.84) v2(60.04,63.27) v2(60.2,6.88) v2(60.2,5.99) v2(60.2,5.23) v2(60.2,4.34) v2(60.43,19.73) v2(60.43,18.84) v2(60.8,16.99) v2(60.91,63.27) v2(61.04,6.88) v2(61.04,5.99) v2(61.04,5.23) v2(61.04,4.34) v2(61.3,8.64) v2(61.3,7.75) v2(61.77,63.27) v2(61.78,30.49) v2(61.78,29.6) v2(61.89,6.88) v2(61.89,5.99) v2(61.89,5.23) v2(61.89,4.34) v2(61.99,38.92) v2(61.99,38.09) v2(62.14,8.64) v2(62.14,7.75) v2(62.63,63.27) v2(62.62,30.49) v2(62.62,29.6) v2(63.5,63.27) v2(64.36,63.27) v2(64.63,19.93) v2(64.63,19.05) v2(64.66,11.7) v2(64.66,10.82) v2(64.86,7.44) v2(64.86,6.55) v2(64.86,5.79) v2(64.86,4.9) v2(65.22,63.27) v2(65.25,27.28) v2(65.25,26.39) v2(65.48,19.93) v2(65.48,19.05) v2(65.51,11.7) v2(65.51,10.82) v2(65.58,38.95) v2(65.63,37.95) v2(65.6,30.19) v2(65.6,29.3) v2(65.7,7.44) v2(65.7,6.55) v2(65.7,5.79) v2(65.7,4.9) v2(66.08,63.27) v2(66.09,27.28) v2(66.09,26.39) v2(66.45,30.19) v2(66.45,29.3) v2(66.58,32.82) v2(66.55,7.44) v2(66.55,6.55) v2(66.55,5.79) v2(66.55,4.9) v2(66.72,59.31) v2(66.72,58.42) v2(66.72,57.62) v2(66.72,56.73) v2(66.9,43.99) v2(66.95,63.27) v2(66.98,61.81) v2(66.98,60.92) v2(67.01,34.2) v2(67.4,7.44) v2(67.4,6.55) v2(67.4,5.79) v2(67.4,4.9) v2(67.57,59.31) v2(67.57,58.42) v2(67.57,57.62) v2(67.57,56.73) v2(67.74,44.88) v2(67.74,43.99) v2(67.81,63.27) v2(67.83,61.81) v2(67.83,60.92) v2(68.59,44.88) v2(68.59,43.99) v2(68.67,63.27) v2(68.78,41.87) v2(69.65,62.55) v2(69.65,61.66) v2(70.5,62.55) v2(70.5,61.66) v2(70.52,8.97) v2(70.52,8.08) v2(70.52,7.32) v2(70.52,6.43) v2(71.35,62.55) v2(71.35,61.66) v2(71.35,11.86) v2(71.35,10.97) v2(71.37,8.97) v2(71.37,8.08) v2(71.37,7.32) v2(71.37,6.43) v2(71.84,29.83) v2(71.84,28.94) v2(71.84,28.18) v2(72.19,62.55) v2(72.19,61.66) v2(72.19,11.86) v2(72.19,10.97) v2(72.21,8.97) v2(72.21,8.08) v2(72.21,7.32) v2(72.21,6.43) v2(72.69,29.83) v2(72.69,28.94) v2(72.69,28.18) v2(73.02,62.52) v2(73.02,61.63) v2(73.06,8.97) v2(73.06,8.08) v2(73.06,7.32) v2(73.06,6.43) v2(73.54,29.83) v2(73.54,28.94) v2(73.54,28.18) v2(74.29,62.45) v2(74.29,61.56) v2(74.35,53.37) v2(74.39,29.83) v2(74.39,28.94) v2(74.39,28.18) v2(75.14,62.45) v2(75.14,61.56) v2(75.2,53.37) v2(75.16,9.22) v2(75.16,8.34) v2(75.16,7.57) v2(75.16,6.68) v2(75.99,62.45) v2(75.99,61.56) v2(76,43.26) v2(76,42.41) v2(76.01,9.22) v2(76.01,8.34) v2(76.01,7.57) v2(76.01,6.68) v2(76.1,46.73) v2(76.1,45.88) v2(76.72,52.74) v2(76.72,51.9) v2(76.83,62.45) v2(76.83,61.56) v2(76.85,9.22) v2(76.85,8.34) v2(76.85,7.57) v2(76.85,6.68) v2(76.97,43.16) v2(76.97,42.31) v2(77.15,46.97) v2(77.15,46.12) v2(77.63,52.79) v2(77.63,51.95) v2(77.66,62.42) v2(77.66,61.53) v2(77.7,9.22) v2(77.7,8.34) v2(77.7,7.57) v2(77.7,6.68) v2(78.07,48.14) v2(78.07,47.25) v2(78.07,46.49) v2(78.07,45.6) v2(78.13,43.04) v2(78.13,42.19) v2(78.81,43.31) v2(78.81,42.46) v2(78.91,48.14) v2(78.91,47.25) v2(78.91,46.49) v2(78.91,45.6) v2(78.98,62.65) v2(78.98,61.76) v2(79.24,28.66) v2(79.24,27.77) v2(79.24,27) v2(79.24,26.12) v2(79.29,12.34) v2(79.29,11.45) v2(79.29,10.68) v2(79.29,9.8) v2(79.83,62.65) v2(79.83,61.76) v2(79.76,48.14) v2(79.76,47.25) v2(79.76,46.49) v2(79.76,45.6) v2(80.09,28.66) v2(80.09,27.77) v2(80.09,27) v2(80.09,26.12) v2(80.14,12.34) v2(80.14,11.45) v2(80.14,10.68) v2(80.14,9.8) v2(80.61,48.14) v2(80.61,47.25) v2(80.61,46.49) v2(80.61,45.6) v2(80.68,62.65) v2(80.68,61.76) v2(80.93,28.66) v2(80.93,27.77) v2(80.93,27) v2(80.93,26.12) v2(80.98,12.34) v2(80.98,11.45) v2(80.98,10.68) v2(80.98,9.8) v2(81.52,62.65) v2(81.52,61.76) v2(81.78,28.66) v2(81.78,27.77) v2(81.78,27) v2(81.78,26.12) v2(81.83,12.34) v2(81.83,11.45) v2(81.83,10.68) v2(81.83,9.8) v2(81.85,24.73) v2(81.85,23.84) v2(82.27,44.74) v2(82.27,43.89) v2(82.35,62.62) v2(82.35,61.73) v2(82.7,24.73) v2(82.7,23.84) v2(83.12,12.74) v2(83.33,28.18) v2(83.33,27.29) v2(83.42,46.64) v2(83.42,45.75) v2(83.53,54.24) v2(83.53,53.35) v2(83.64,23.89) v2(83.64,23) v2(83.68,11.88) v2(84.17,28.18) v2(84.17,27.29) v2(84.27,46.64) v2(84.27,45.75) v2(84.38,54.24) v2(84.38,53.35) v2(84.48,23.89) v2(84.48,23) v2(85.12,46.64) v2(85.12,45.75) v2(85.21,14.51) v2(85.21,13.74) v2(85.21,12.86) v2(85.96,46.64) v2(85.96,45.75) v2(86.05,15.4) v2(86.05,14.51) v2(86.05,13.74) v2(86.05,12.86) v2(86.79,46.61) v2(86.79,45.72) v2(86.9,15.4) v2(86.9,14.51) v2(86.9,13.74) v2(86.9,12.86) v2(87.64,46.61) v2(87.64,45.72) v2(87.75,15.4) v2(87.75,14.51) v2(87.75,13.74) v2(87.75,12.86) v2(88.38,44.29) v2(89.38,44.14) v2(90.36,50.16) v2(90.36,49.27) v2(91.2,50.16) v2(91.2,49.27) v2(92.05,50.16) v2(92.05,49.27) v2(92.5,47.97) v2(92.5,47.08) v2(92.9,50.16) v2(92.9,49.27) v2(93.35,47.97) v2(93.35,47.08) v2(93.49,12.56) v2(93.72,50.13) v2(93.72,49.24) v2(94.06,24.58) v2(94.06,23.69) v2(94.19,47.97) v2(94.19,47.08) v2(94.38,12.56) v2(94.38,11.71) v2(94.84,44.35) v2(94.84,43.5) v2(94.84,42.65) v2(94.84,41.81) v2(94.87,45.17) v2(94.92,40.43) v2(94.89,39.6) v2(94.89,38.76) v2(94.89,37.91) v2(94.89,37.06) v2(94.91,24.58) v2(94.91,23.69) v2(95.04,47.97) v2(95.04,47.08) v2(95.14,12.56) v2(95.14,11.71) v2(95.73,44.35) v2(95.73,43.5) v2(95.73,42.65) v2(95.73,41.81) v2(95.76,45.17) v2(95.81,40.43) v2(95.78,39.6) v2(95.78,38.76) v2(95.78,37.91) v2(95.78,37.06) v2(95.75,24.58) v2(95.75,23.69) v2(95.87,47.93) v2(95.87,47.04) v2(96.03,12.56) v2(96.03,11.71) v2(96.06,36.07) v2(96.06,35.21) v2(96.06,34.35) v2(96.06,33.48) v2(96.06,32.62) v2(96.06,31.76) v2(96.16,30.77) v2(96.16,29.91) v2(96.16,29.04) v2(96.16,28.18) v2(96.16,27.32) v2(96.16,26.45)
VCC: length 231.6
  Top Layer w0.3: 67.32,40.14 67.18,40 62.63,40 62.4,40.23 U7.15 ; 46.15,40.23 46.99,40.23 47.23,39.99 C38.1
  Top Layer w0.4: 21.65,40.99 21.82,40.99 23.89,43.07 C11.2 26.99,43.64 U4.5 ; 21.65,40.99 21.44,40.99 ; 21.65,40.99 21.57,40.91 21.53,40.91 ; 72.76,26.98 72.85,26.89 U9.5
  Top Layer w0.5: R32.2 45.39,32.94 45.3,32.86 ; 28.77,33.01 28.78,33.01 U1.16 ; R2.1 87.11,48.62 91.24,44.49 91.24,37.9 90.17,36.83 90.17,27.75 C20.1 ; 41.42,32.86 41.41,32.87 R39.1 ; 23.68,38.8 23.64,38.8 ; U4.5 28.27,43.39
  Top Layer w0.6: P8.3 85.8,19.16 ; 85.8,19.16 85.73,19.23 ; 85.8,19.16 85.68,19.05 C9.2 ; 21.81,40.63 16.79,35.61 H1.1 13.82,36.77 9.93,40.66 P9.3 ; C19.1 68.53,35.78 67.32,36.99 67.32,40.14 ; R31.2 61.23,31.74 61.28,31.69 ; R38.1 57.13,31.73 57.08,31.69 ; C38.1 51.05,32.86
  Top Layer w0.8: 21.44,40.99 16.01,46.42 16.01,61.5 P4.5 ; 21.53,40.91 21.81,40.63 23.64,38.8 28.77,33.66 28.77,33.01 30.91,33.01 v2(31.26,32.65) ; v2(39.17,32.86) 54.01,32.86 55.03,31.84 56.93,31.84 57.08,31.69 C19.1 ; L1.1 88.31,35.02 85.86,37.48 U6.3
  Top Layer w1: L1.1 88.44,32.88 C20.1 88.44,22.62 85.07,19.25 ; C19.1 68.53,28.38 69.93,26.98 76.76,26.98 80.37,23.36 U2.3 85.07,19.25
  Bottom Layer w0.8: v2(39.17,32.86) 31.47,32.86 v2(31.26,32.65)
(no net):
  vias: v1(83.9,42.64) v1(83.9,42) v1(83.9,41.37) v1(83.9,40.73) v1(84.52,42.63) v1(84.52,41.99) v1(84.52,41.35) v1(84.52,40.71) v1(85.14,42.64) v1(85.14,42) v1(85.14,41.37) v1(85.14,40.73) v1(85.82,42.61) v1(85.82,41.97) v1(85.82,41.34) v1(85.82,40.7) v1(86.57,42.62) v1(86.57,41.98) v1(86.57,41.35) v1(86.57,40.71)
BOOT0: length 7.5
  Top Layer w0.3: R7.2 41.79,23.02 41.8,23.03 U5.44
BOOT1: length 5.2
  Top Layer w0.3: U5.20 62.2,24.53 R8.2
LO: length 48.3
  Top Layer w0.3: v2(88.38,20.04) 90.53,20.04 92.41,21.93 R5.2 ; v2(51.15,17.92) 51.03,18.03 U5.3
  Bottom Layer w0.3: v2(88.38,20.04) 86.26,17.92 v2(51.15,17.92)
LO_OUT: length 8.5
  Top Layer w0.8: P2.1 82.24,55.61 80.26,53.64 F1.2
LX_O: length 8.9
  Top Layer w0.5: C22.2 21.46,54.76 R16.1 21.46,61.28 P4.3
LY_O: length 8.9
  Top Layer w0.5: P4.2 23.56,61.33 R14.1 25.64,54.77 C18.1
MOTOR_EN: length 53.3
  Top Layer w0.3: U5.16 61.41,22.53 61.42,22.54 R12.1 ; v2(39.98,42.85) 40.11,42.73 41.15,42.73 ; U7.2 55.59,42.73 v2(55.33,42.99) ; v2(51.97,35.15) 54.67,37.86 v2(55.84,37.86)
  Bottom Layer w0.3: v2(51.97,35.15) 41.56,35.15 39.98,36.73 v2(39.98,42.85) ; v2(55.33,42.99) 55.33,41.38 55.84,40.87 v2(55.84,37.86) 55.84,35.77 58.65,32.96 v2(58.65,22.56)
MX_1A: length 21.9
  Top Layer w0.3: U7.24 59.56,44.23 59.56,44.92 60.69,46.05 60.79,46.05
  Top Layer w0.8: 61.1,52.69 61.05,52.74 61.05,58.29 62.3,59.54 62.3,61.48 P6.2 ; 61.1,52.69 61.05,52.64 61.05,46.31 60.79,46.05 ; 61.1,52.69 61.13,52.65 R20.1
MX_1B: length 22.4
  Top Layer w0.3: U7.21 61.95,43.23 62.53,43.81
  Top Layer w0.8: P6.1 64.47,61.01 R18.1 65.52,55.25 66.05,54.72 66.05,46.21 63.9,44.06 62.58,44.06
MX_2A: length 20
  Top Layer w0.3: 59.16,45.59 58.56,44.99 U7.26
  Top Layer w0.8: R21.1 59.59,52.65 59.62,52.68 ; 59.31,45.85 59.81,46.34 P6.3
MX_2B: length 19.9
  Top Layer w0.3: 55.95,44.27 55.9,44.22 55.9,43.4 56.07,43.23 U7.1
  Top Layer w0.8: 55.9,44.57 55.61,44.86 55.61,54.93 56.03,55.35 R25.1 57.17,55.46 P6.4
MX_DIR: length 28.3
  Top Layer w0.3: U5.13 59.98,21.03 v2(60.84,21.89) ; v2(63.65,42.65) 63.23,42.23 U7.19
  Bottom Layer w0.3: v2(63.65,42.65) 63.65,24.7 v2(60.84,21.89)
MX_STEP: length 26.1
  Top Layer w0.3: U5.10 54.53,25.53 v2(59.75,30.74) ; U7.16 62.92,40.73 v2(62.98,40.66)
  Bottom Layer w0.3: v2(62.98,40.66) 62.98,33.98 v2(59.75,30.74)
MY1_1A: length 22.5
  Top Layer w0.3: 44.63,46.61 44.15,46.14 U8.24
  Top Layer w0.8: 44.63,46.61 44.63,56.1 48.24,59.72 P7.2 ; 44.83,52.79 44.85,52.76 R22.1
MY1_1B: length 22.4
  Top Layer w0.3: 47.12,43.66 46.7,43.23 46.15,43.23
  Top Layer w0.8: 47.28,43.91 47.58,43.91 50.08,46.41 50.08,54.77 49.47,55.39 48.41,55.39 48.45,55.43 48.45,57.78 50.88,60.22 P7.1
MY1_2A: length 21.8
  Top Layer w0.3: 43.15,46.05 43.15,46.05 U8.26
  Top Layer w0.8: 43.15,46.05 43.15,52.84 ; 43.15,52.84 43.15,56.76 45.7,59.32 P7.3 ; 43.15,52.84 43.09,52.79 R26.1
MY1_2B: length 22.6
  Top Layer w0.3: 41.15,43.23 40.87,43.23 40.57,43.53 40.57,43.99
  Top Layer w0.8: 40.47,44.19 37.89,46.77 37.89,55.03 38.31,55.45 39.69,55.45 R30.1 39.74,58.2 P7.4
MY_DIR: length 27.7
  Top Layer w0.3: U5.14 55.85,21.53 55.44,21.94 v2(55.44,25.06) ; 46.15,42.23 47.11,42.23 v2(47.58,42.7)
  Bottom Layer w0.3: v2(47.58,42.7) 47.94,42.7 55.44,35.2 v2(55.44,25.06)
MY_STEP: length 26.1
  Top Layer w0.3: v2(47.91,40.64) 47.82,40.73 46.15,40.73 ; v2(55.28,21.08) 55.03,20.83 U5.11
  Bottom Layer w0.3: v2(47.91,40.64) 47.91,40.21 53.8,34.32 53.8,22.56 v2(55.28,21.08)
NRST: length 12.1
  Top Layer w0.3: U5.7 53.03,18.18 54.72,16.49 59.24,16.49 59.96,15.77 60.76,15.77 60.69,15.71 C12.2
PA7_SPI: length 13.2
  Top Layer w0.3: U9.2 70.04,23.44 R44.1 66.16,23.44 66.15,23.46 58.65,23.46 58.22,23.03 U5.17
PA15: length 43
  Top Layer w0.3: v2(23.1,40.75) 29.53,34.32 33.35,34.32 v2(36.16,31.52) ; v2(17.44,41.21) 17.32,41.33 R45.1 13.42,41.33 U10.2 ; U5.38 45.1,26.03 44.73,25.65 42.53,25.65 41.97,26.21 39.32,26.21 v2(37.23,28.31)
  Bottom Layer w0.3: v2(23.1,40.75) 17.9,40.75 v2(17.44,41.21) ; v2(36.16,31.52) 37.23,30.45 v2(37.23,28.31)
PA15_TIM2: length 16
  Top Layer w0.3: P9.2 3.59,42.31 U10.4
  Top Layer w0.6: P9.2 3.68,44.38 D9.2
PWM_5V: length 17.4
  Top Layer w0.4: R10.1 28.07,49.54 30.34,51.82 30.34,57.53 31.81,59 P3.3
RGB_SPI: length 29.4
  Top Layer w0.4: U9.4 v2(78.44,22.51)
  Top Layer w0.8: D8.2 94.1,17.03 P8.2
  Bottom Layer w0.4: P8.2 90.07,21.06 79.89,21.06 v2(78.44,22.51)
RST: length 37.6
  Top Layer w0.3: R33.1 40.24,4.84 43.35,7.96 v2(43.35,20.01) ; C7.2 33.56,24.53 U5.41
  Bottom Layer w0.3: v2(43.35,20.01) v2(43.35,24.55)
RXD: length 20
  Top Layer w0.3: 34.31,29.29 46.51,29.29 47.28,30.05 51.61,30.05 52.53,29.13 U5.31
SPINDLE_PWM: length 33.3
  Top Layer w0.3: U5.29 53.53,29.97 52.33,31.18 37.89,31.18 33.86,35.2 30.55,35.2 29.19,36.57 R9.1 29.22,38.25 U4.2
SWCLK: length 21.7
  Top Layer w0.3: v2(44.22,26.53) 47.28,26.53 47.28,26.53 U5.37
  Bottom Layer w0.3: v2(44.22,26.53) 41.77,26.53 39.12,23.88 39.12,17.07 P5.3
SWDIO: length 21.8
  Top Layer w0.3: U5.34 v2(51.03,22.25)
  Bottom Layer w0.3: P5.4 42.72,13.94 v2(51.03,22.25)
TXD: length 21
  Top Layer w0.3: U5.30 53.03,29.7 52.14,30.6 34.93,30.6 34.31,31.23 34.31,31.28
USB_DM: length 6
  Top Layer w0.4: 8.17,25.83 10.33,25.83 11.7,24.46 U3.3
USB_DP: length 8.3
  Top Layer w0.4: U3.1 10.92,26.36 10.15,27.13 7.47,27.13 6.17,25.83
VM: length 85.1
  Top Layer w0.3: U8.22 45.16,44.49 46.31,45.65 ; U7.22 61.47,44.23 ; U8.28 42.15,44.7 41.67,45.19 ; 57.56,44.23 57.56,45.21 57.28,45.48 v2(57.28,46.21) ; 63.44,46.21 v2(63.44,46.36)
  Top Layer w0.5: 61.47,44.23 63.44,46.21
  Top Layer w0.6: C34.2 52.89,45.67 v2(52.89,45.95) ; C35.2 37.43,45.47 v2(37.43,45.9) ; 41.67,45.19 v2(40.72,46.13) 40.72,46.63 C29.1 ; C27.1 v2(57.28,46.21) ; C28.1 64.55,47.47 v2(63.44,46.36) ; 46.31,45.65 46.92,46.26 v2(47.07,46.26) 47.15,46.26 C30.1
  Top Layer w0.8: D2.1 71.09,38.89 C2.1
  Top Layer w1.5: D2.1 71.14,44.17 C3.1 ; v2(33.25,47.18) 31.93,48.5 C4.1
  Top Layer w2: C3.1 71.46,46.99 70.36,48.09 P2.4
  Bottom Layer w0.6: v2(37.43,45.9) 37.94,46.41
  Bottom Layer w1.5: v2(70.43,47.9) 68.94,46.41 34.02,46.41 v2(33.25,47.18)
  vias: v2(33.18,46.54) v2(33.9,47.07) v2(69.77,47.85) v2(70.43,47.24)
VUSB: length 21.9
  Top Layer w0.4: U3.5 15.55,25.41 14.99,25.97 14.99,27.14 13.82,28.31 H1.2
  Top Layer w0.6: 8.17,23.33 9.2,23.33 v2(10.2,24.33)
  Bottom Layer w0.6: v2(10.2,24.33) 10.2,29.45 H1.2
X_LIMT: length 54
  Top Layer w0.3: R17.1 21.2,48.84 v2(21.32,48.72) 21.42,48.62 R42.1 ; v2(32.69,44.38) 32.69,37.91 38.52,32.08 53.31,32.08 55.53,29.85 U5.25
  Top Layer w0.5: R17.1 21.46,50.72 R16.2
  Bottom Layer w0.3: v2(32.69,44.38) 31.42,44.38 27.95,47.85 22.18,47.85 v2(21.32,48.72)
XTAL1: length 12.4
  Top Layer w0.3: 47.48,13.27 47.9,13.27 52.03,17.41 U5.5 ; Y2.1 47.17,13.11 C17.1
XTAL2: length 12.8
  Top Layer w0.3: U5.6 52.53,17.4 56.66,13.27 57.48,13.27 57.33,13.13 C16.1
Y_LIMT: length 50.9
  Top Layer w0.3: R43.2 23.77,47.36 v2(23.77,48.72) 23.58,48.91 R13.2 ; U5.28 54.03,30.23 52.64,31.63 38.15,31.63 32.13,37.65 32.13,45.05 v2(31.31,45.86)
  Top Layer w0.5: R14.2 23.56,50.47 R13.2
  Bottom Layer w0.3: v2(23.77,48.72) 28.46,48.72 v2(31.31,45.86)
$1N85912: length 3.9
  Top Layer w0.3: C32.2 53.95,39.63 54.52,40.2 54.52,40.71 55.04,41.23 U7.5
$1N85916: length 3.2
  Top Layer w0.3: U7.4 54.16,41.73 53.61,41.18 C32.1
$1N85918: length 5.4
  Top Layer w0.3: C34.1 53.65,43.36 v2(53.65,42.4) ; U7.6 55.71,40.73 v2(55.23,40.25)
  Bottom Layer w0.3: v2(55.23,40.25) 53.65,41.83 v2(53.65,42.4)
$1N85922: length 4.4
  Top Layer w0.3: 57.56,39.23 57.56,38.4 55.08,35.92 C40.1
$1N85924: length 3.7
  Top Layer w0.3: R40.1 59.22,35.9 60.06,36.74 U7.13
$1N85949: length 8.8
  Top Layer w0.3: 61.51,45.34 60.67,45.34 60.06,44.73 U7.23
  Top Layer w0.5: R24.2 63.32,50.06 62.17,48.91 62.17,46 61.51,45.34
$1N85962: length 7.5
  Top Layer w0.3: 58.8,47.33 58.8,46.36 58.06,45.62 U7.27
  Top Layer w0.5: R23.1 58.16,50.06 58.8,49.42 58.8,47.33
$1N85980: length 4.6
  Top Layer w0.3: 41.15,41.23 39.38,41.23 38.14,39.99 C33.2
$1N85984: length 4.2
  Top Layer w0.3: 41.15,41.73 38.93,41.73 38.74,41.54 C33.1
$1N85986: length 6.5
  Top Layer w0.3: 41.15,40.73 39.85,40.73 v2(39.27,40.15) ; v2(37.99,42.65) 37.14,43.51 C35.1
  Bottom Layer w0.3: v2(37.99,42.65) 37.99,41.43 v2(39.27,40.15)
$1N85990: length 5
  Top Layer w0.3: U8.8 42.15,38.5 40.85,37.19 39.93,37.19 39.42,36.68 C41.1
$1N85992: length 3.8
  Top Layer w0.3: U8.13 44.65,37.89 43.39,36.63 R41.1
$1N86002: length 11.4
  Top Layer w0.3: v2(48.96,40.61) 49.06,40.71 C39.1 48.92,41.48 47.84,41.48 47.59,41.23 46.15,41.23 ; R35.2 R37.1 49.37,36.7 49.93,37.26 v2(49.93,39.28)
  Bottom Layer w0.3: v2(49.93,39.28) 49.93,39.64 v2(48.96,40.61)
$1N86020: length 8.5
  Top Layer w0.3: 45.24,45.65 44.65,45.06 U8.23
  Top Layer w0.5: 45.24,45.65 45.54,45.95 45.54,49.11 46.52,50.09 48.41,50.09
$1N86033: length 7.9
  Top Layer w0.3: U8.27 42.65,45.48 42.28,45.85
  Top Layer w0.5: 42.28,45.85 42.08,46.05 42.08,49.11 41.01,50.18 R28.1
$1N86106: length 12.5
  Top Layer w0.3: U7.12 59.56,38.26 59.26,37.96 58.39,37.96 ; 58.06,37.97 58.07,37.96 58.39,37.96 ; 58.06,37.97 58.56,38.47 U7.10 ; 58.06,37.97 U7.9 ; 58.06,37.97 58.06,36.79 57.18,35.9 R38.2 ; 58.39,37.96 58.67,38.24 ; v2(60.69,38.06) 60.56,38.19 U7.14 ; U7.11 59.06,38.37 58.8,38.11
  Bottom Layer w0.3: v2(60.69,38.06) v2(58.8,38.06)
$1N86116: length 10.8
  Top Layer w0.3: U8.9 42.65,37.93 ; 42.65,37.93 41.41,36.68 R39.2 ; 42.65,37.93 42.89,38.16 ; 42.89,38.16 43.15,38.43 U8.10 ; 42.89,38.16 43.55,38.16 ; U8.11 43.65,38.26 ; 43.81,38.16 44.15,38.51 U8.12 ; v2(45.24,38.21) 45.16,38.29 U8.14
  Bottom Layer w0.3: v2(45.24,38.21) v2(43.71,38.21)
$1N86149: length 3.4
  Top Layer w0.4: U1.4 20.36,27.25 19.8,27.81
$1N86156: length 3.7
  Top Layer w0.5: C7.1 32.39,27.25 U1.13
$1N86170: length 6.6
  Top Layer w0.3: U3.6 17.29,26.36 17.68,25.98 U1.5
$1N86179: length 6.6
  Top Layer w0.3: U1.6 17.54,24.71 17.29,24.46 U3.4
$1N86183: length 10.8
  Top Layer w0.3: C8.1 19.52,18.24 Y1.2
  Top Layer w0.4: U1.7 21.64,23.44 19.44,21.24 Y1.2
$1N86186: length 8.9
  Top Layer w0.3: Y1.1 25,18.29 C10.1
  Top Layer w0.4: Y1.1 25.04,21.29 24.18,22.14 U1.8
$1N86190: length 2.3
  Top Layer w0.4: R10.2 30.17,45.19 U4.4
$1N86205: length 24.5
  Top Layer w0.5: F1.1 86.24,51.37 93.28,44.33 Q1.2
  Top Layer w0.6: R2.2 83.24,48.72 F1.1
$1N86244: length 5.9
  Top Layer w0.5: R5.1 92.38,27.32 R6.1 92.28,30.56 Q1.1
$1N86264: length 1.8
  Top Layer w0.4: R1.2 68.08,12.44 D4.1
$1N86304: length 10
  Top Layer w0.3: R3.1 32.66,29.24 v2(31.06,29.24) ; U1.2 v2(26.37,29.79)
  Bottom Layer w0.3: v2(26.37,29.79) 30.51,29.79 v2(31.06,29.24)
$1N86306: length 11.4
  Top Layer w0.3: R4.1 32.25,30.82 v2(30.8,30.82) ; U1.3 v2(24.89,28.52)
  Bottom Layer w0.3: v2(30.8,30.82) 26.31,30.82 24.89,29.39 v2(24.89,28.52)
$1N86352: length 18.2
  Top Layer w0.3: C31.2 23.66,4.58 K1.3 K1.4 34.98,2.92 35.31,3.24 R33.2
$1N86386: length 1.8
  Top Layer w0.3: D7.1 37.79,4.94 R27.1
$1N86869: length 10.5
  Top Layer w0.8: U6.2 84.59,37.68 81.52,34.61 L1.2 80.29,31.79 D5.2
$1N86871: length 3.9
  Top Layer w0.5: R15.1 89.35,39.44 88.64,38.72 U6.4
$1N92113: length 2.7
  Top Layer w0.3: R31.1 61.68,35.9 R34.1
$1N92147: length 11.5
  Top Layer w0.3: U7.17 62.69,41.23 62.77,41.31 C37.1 64.58,40.66 v2(64.51,40.66) ; 64.43,35.9 R36.1 ; 64.43,35.9 v2(64.41,35.92) ; 64.43,35.9 R34.2
  Bottom Layer w0.3: v2(64.51,40.66) 64.51,36.02 v2(64.41,35.92)
$1N92216: length 2.7
  Top Layer w0.3: R32.1 45.78,35.9 R35.1

## Copper pours and planes (outline as drawn; the poured copper is in the pictures)
GND on Top Layer: -3.11,65.94 99.45,65.94 99.45,-2.29 -3.11,-2.29
GND on Bottom Layer: -2.39,65.94 99.6,65.94 99.6,-1.63 -2.39,-1.63

Small or netless copper shapes (teardrops, artwork), in the pictures only: 356 on Top Layer, 64 on Bottom Layer

## Text on the board
Top Silkscreen Layer: GND | 3V3 | PWM | 24V | VCC | LO | 5V | LX | LY | RGB | Rest | Y-MOTOR | X-MOTOR
